# EAGLE schematic usb415 (EAGLE 7.7.0)
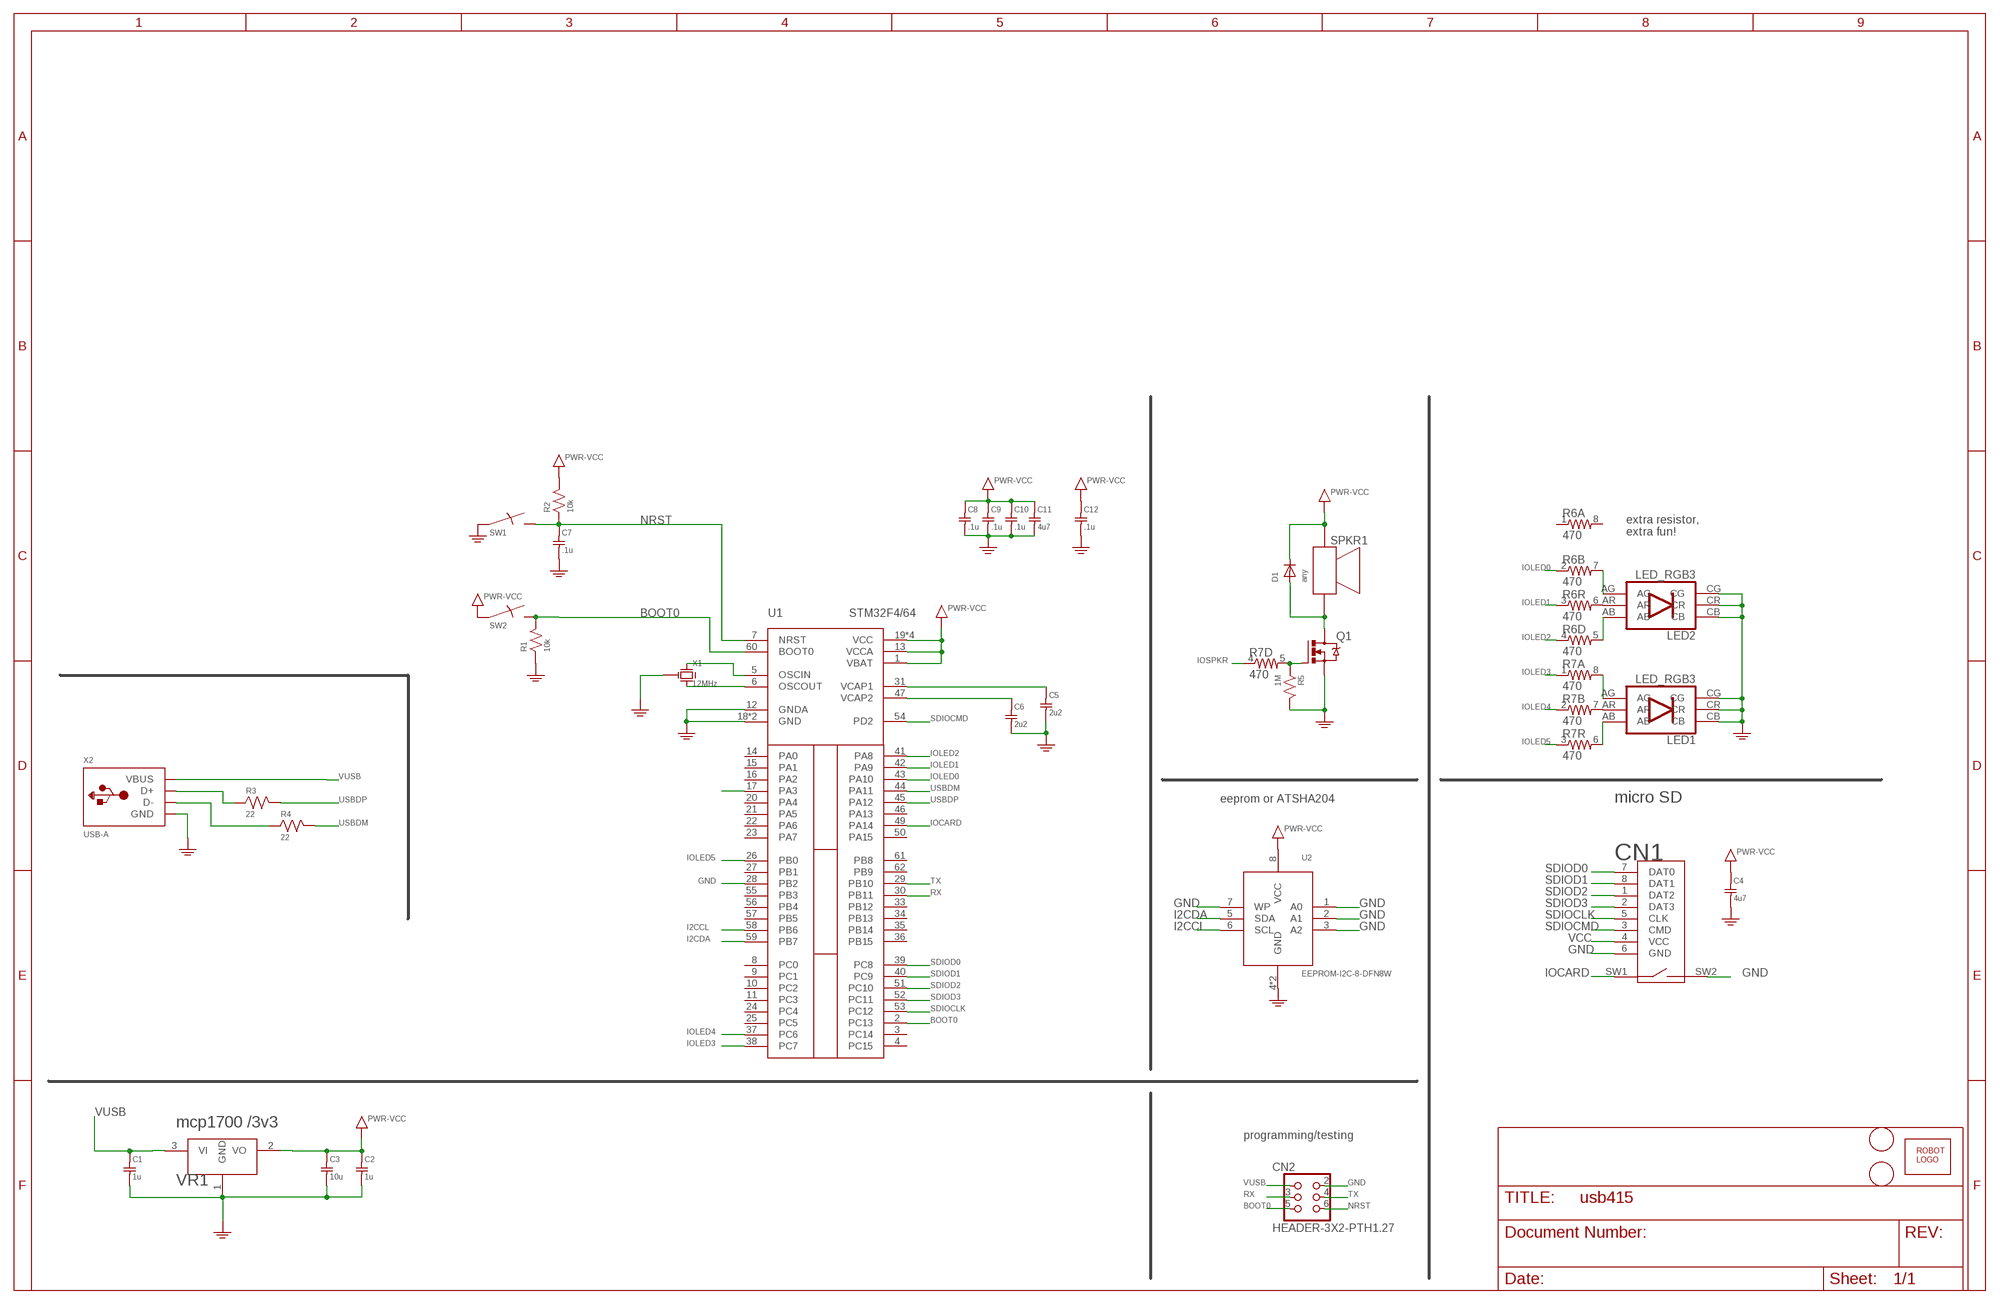
[diagram p0: schematic, sheet 1]

## Parts
C1  1u  C0603  [SMD0603]
C2  1u  C0603  [SMD0603]
C3  10u  C0603  [SMD0603]
C4  4u7  C0603  [SMD0603]
C5  2u2  C0603  [SMD0603]
C6  2u2  C0603  [SMD0603]
C7  .1u  C0603  [SMD0603]
C8  .1u  C0603  [SMD0603]
C9  .1u  C0603  [SMD0603]
C10  .1u  C0603  [SMD0603]
C11  4u7  C0603  [SMD0603]
C12  .1u  C0603  [SMD0603]
CN1  MICROSDPLAIN  [MICROSD/MOLEX/FRONT/PLAIN]
CN2  HEADER-3X2-PTH1.27  [HEADER-3X2-PTH1.27]
D1  any  DIODESOD-323  [SOD-323]
LED1  LED_RGB3  [SMDLEDRGB]
LED2  LED_RGB3  [SMDLEDRGB]
Q1  IRLML6344TRPBF  MOSFETSOT-23  [SOT-23]
R1  10k  R0603  [SMD0603]
R2  10k  R0603  [SMD0603]
R3  22  R0603  [SMD0603]
R4  22  R0603  [SMD0603]
R5  1M  R0603  [SMD0603]
R6  470  R-ARRAY40603-ARV  [SMD-0603-ARV]
R7  470  R-ARRAY40603-ARV  [SMD-0603-ARV]
SPKR1  SPKR-PUI-0440  [PUI-0440]
SW1  SWITCHKMR211  [KMR211]
SW2  SWITCHKMR211  [KMR211]
U1  STM32F4/64  [TQFP64]
U2  EEPROM-I2C-8-DFN8W  [TDFN8EPW]
U$1  ROBOTMAN-LOGO  [ROBOTMAN-LOGO]
U$2  FIDUCIAL  [FIDUCIAL_1MM]
U$3  FIDUCIAL  [FIDUCIAL_1MM]
VR1  mcp1700 /3v3  REGULATOR-SOT23-3  [SOT-23-3]
X1  12MHz  RESONATORCTCE  [RESONATOR-CSTCE]
X2  USB-A  [MOLEX_480371000]

## Nets
BOOT0: CN2.5 R1.2 SW2.2 SW2.4 U1.2(PC13) U1.60(BOOT0)
GND: C1.2 C2.2 C3.2 C4.2 C5.2 C6.2 C7.2 C8.2 C9.2 C10.2 C11.2 C12.2 CN1.6(GND) CN1.SW2 CN2.2 LED1.CB LED1.CG LED1.CR LED2.CB LED2.CG LED2.CR Q1.2(S) R1.1 R5.2 SW1.1 SW1.3 U1.12(GNDA) U1.18(GND) U1.28(PB2) U1.63(GND) U2.1(A0) U2.2(A1) U2.3(A2) U2.4(GND) U2.7(WP) U2.PAD(GND) VR1.1(GND) X1.2(G) X2.4(GND) ; supply symbol labelled PWR-GND
I2CCL: U1.58(PB6) U2.6(SCL)
I2CDA: U1.59(PB7) U2.5(SDA)
IOCARD: CN1.SW1 U1.49(PA14)
IOLED0: R6.2 U1.43(PA10)
IOLED1: R6.3 U1.42(PA9)
IOLED2: R6.4 U1.41(PA8)
IOLED3: R7.1 U1.38(PC7)
IOLED4: R7.2 U1.37(PC6)
IOLED5: R7.3 U1.26(PB0)
IOSPKR: R7.4 U1.17(PA3)
N$1: LED1.AG R7.8
N$2: LED1.AR R7.7
N$3: LED1.AB R7.6
N$4: C6.1 U1.47(VCAP2)
N$5: LED2.AG R6.7
N$6: LED2.AR R6.6
N$7: R4.1 X2.2(D-)
N$8: R3.1 X2.3(D+)
N$9: Q1.1(G) R5.1 R7.5
N$10: LED2.AB R6.5
N$12: U1.5(OSCIN) X1.1(X1)
N$13: U1.6(OSCOUT) X1.3(X2)
N$14: D1.A Q1.3(D) SPKR1.P$2(P2)
N$18: C5.1 U1.31(VCAP1)
NRST: C7.1 CN2.6 R2.1 SW1.2 SW1.4 U1.7(NRST)
RX: CN2.3 U1.30(PB11)
SDIOCLK: CN1.5(CLK) U1.53(PC12)
SDIOCMD: CN1.3(CMD) U1.54(PD2)
SDIOD0: CN1.7(DAT0) U1.39(PC8)
SDIOD1: CN1.8(DAT1) U1.40(PC9)
SDIOD2: CN1.1(DAT2) U1.51(PC10)
SDIOD3: CN1.2(DAT3) U1.52(PC11)
TX: CN2.4 U1.29(PB10)
USBDM: R4.2 U1.44(PA11)
USBDP: R3.2 U1.45(PA12)
VCC: C2.1 C3.1 C4.1 C8.1 C9.1 C10.1 C11.1 C12.1 CN1.4(VCC) D1.C R2.2 SPKR1.P$1(P1) SW2.1 SW2.3 U1.1(VBAT) U1.13(VCCA) U1.19(VCC) U1.32(VCC) U1.48(VCC) U1.64(VCC) U2.8(VCC) VR1.2(VO) ; supply symbol labelled PWR-VCC
VUSB: C1.1 CN2.1 VR1.3(VI) X2.1(VBUS)
Unconnected: R6.1 R6.8 U1.3(PC14) U1.4(PC15) U1.8(PC0) U1.9(PC1) U1.10(PC2) U1.11(PC3) U1.14(PA0) U1.15(PA1) U1.16(PA2) U1.20(PA4) U1.21(PA5) U1.22(PA6) U1.23(PA7) U1.24(PC4) U1.25(PC5) U1.27(PB1) U1.33(PB12) U1.34(PB13) U1.35(PB14) U1.36(PB15) U1.46(PA13) U1.50(PA15) U1.55(PB3) U1.56(PB4) U1.57(PB5) U1.61(PB8) U1.62(PB9)

## Notes on the sheet
- extra resistor,
  extra fun!
- eeprom or ATSHA204 | micro SD
- programming/testing

## Library data of the parts
C1-C12 = jaw:C
CN1 = jaw:MICROSD
CN2 = jaw:HEADER-3X2
D1 = jaw:DIODE
LED1 LED2 = jaw:LED_RGB3
Q1 = jaw:MOSFET
R1-R5 = jaw:R
R6 R7 = jaw:R-ARRAY4: Array Chip Resistor Source: RS Component / Phycomp
SPKR1 = jaw:SPKR
SW1 SW2 = jaw:SWITCH
U1 = jaw:STM32F4/64
U2 = jaw:EEPROM-I2C-8
U$1 = jaw:ROBOTMAN-LOGO
U$2 U$3 = adafruit:FIDUCIAL: For use by pick and place machines to calibrate the vision/machine, 1mm By microbuilder.eu
VR1 = jaw:REGULATOR
X1 = jaw:RESONATOR
X2 = jaw:USB-A: USB type A 'plug' Used for things that can directly connect to a USB port, say USB key